# EAGLE design Modulo Ignicao Enertron.proto (EAGLE 7.4.0)
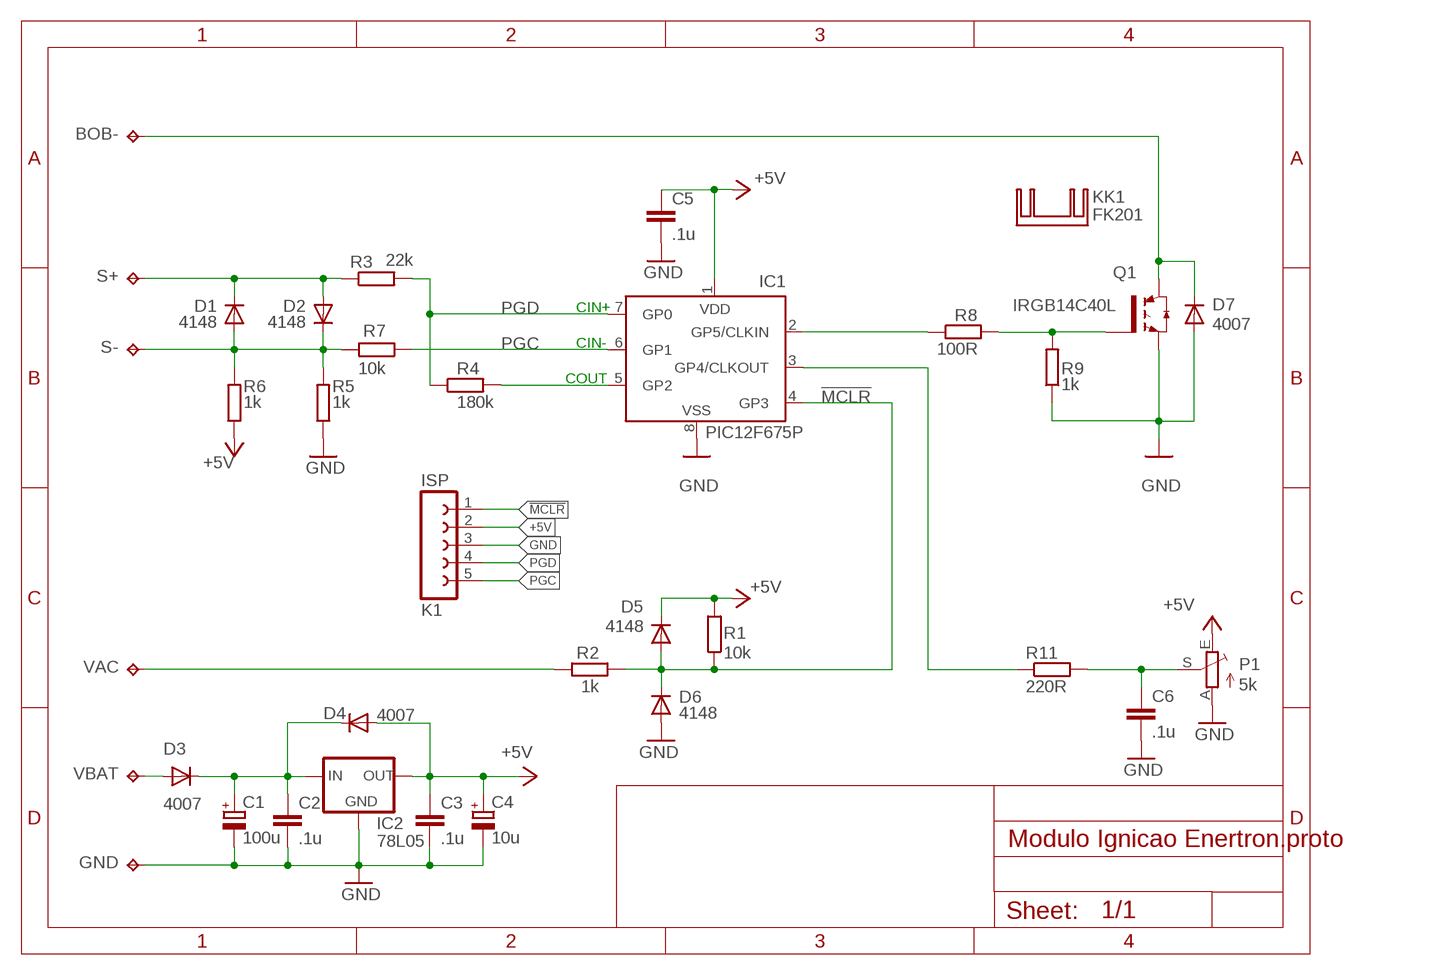
[diagram p0: schematic, sheet 1]

## Parts
BOB-  TPPAD1-13Y  [P1-13Y]
C1  100u  CPOL-EUE2.5-6  [E2,5-6]
C2  .1u  C-EUC050-025X075L  [C050-025X075L]
C3  .1u  C-EUC050-025X075L  [C050-025X075L]
C4  10u  CPOL-EUE2-4  [E2-4]
C5  .1u  C-EUC050-025X075L  [C050-025X075L]
C6  .1u  C-EUC050-025X075L  [C050-025X075L]
D1  4148  DIODE-D-5L  [D-5L]
D2  4148  DIODE-D-5L  [D-5L]
D3  4007  DIODE-D-7.5  [D-7.5]
D4  4007  DIODE-D-7.5  [D-7.5]
D5  4148  DIODE-D-5L  [D-5L]
D6  4148  DIODE-D-5L  [D-5L]
D7  4007  DIODE-DO07  [DO07]
GND  TPPAD1-13Y  [P1-13Y]
IC1  PIC12F675P  [DIL8]
IC2  78L05  78LXX-  [TO92-]
K1  ISP  FE05-1  [FE05-1]
KK1  FK201  [FK201]
P1  5k  TRIM_EU-CA6V  [CA6V]
Q1  IRGB14C40L  IRG4BC15UD--L  [TO262-V]
R1  10k  R-EU_0207/7L  [0207/7L]
R2  1k  R-EU_0207/7L  [0207/7L]
R3  22k  R-EU_0207/7L  [0207/7L]
R4  180k  R-EU_0207/7L  [0207/7L]
R5  1k  R-EU_0207/7L  [0207/7L]
R6  1k  R-EU_0207/7L  [0207/7L]
R7  10k  R-EU_0207/7L  [0207/7L]
R8  100R  R-EU_0207/7L  [0207/7L]
R9  1k  R-EU_0207/7L  [0207/7L]
R11  220R  R-EU_0207/7L  [0207/7L]
S+  TPPAD1-13Y  [P1-13Y]
S-  TPPAD1-13Y  [P1-13Y]
VAC  TPPAD1-13Y  [P1-13Y]
VBAT  TPPAD1-13Y  [P1-13Y]

## Nets
!MCLR: D5.A D6.C IC1.4(GP3) K1.1 R1.3 R2.3
+5V: C3.1 C4.+ C5.1 D4.A D5.C IC1.1(VDD) IC2.3(OUT) K1.2 P1.E R1.4 R6.3
COUT: IC1.5(GP2) R4.4
GND: C1.- C2.2 C3.2 C4.- C5.2 C6.2 D6.A D7.A GND.TP IC1.8(VSS) IC2.2(GND) K1.3 P1.A Q1.3(E) R5.3 R9.3
N$1: C1.+ C2.1 D3.C D4.C IC2.1(IN)
N$2: D1.A D2.C R5.4 R6.4 R7.4 S-.TP
N$3: IC1.2(GP5/CLKIN) R8.3
N$5: D1.C D2.A R3.3 S+.TP
N$6: Q1.1(G) R8.4 R9.4
N$7: D3.A VBAT.TP
N$8: IC1.3(GP4/CLKOUT) R11.3
N$9: C6.1 P1.S R11.4
N$10: BOB-.TP D7.C Q1.2(C)
N$11: R2.4 VAC.TP
PGC: IC1.6(GP1) K1.5 R7.3
PGD: IC1.7(GP0) K1.4 R3.4 R4.3

## Notes on the sheet
- CIN+
- CIN-
- COUT

## Library data of the parts
BOB- GND S+ S- VAC VBAT = testpad:TP: Test pad
C1 C4 = rcl:CPOL-EU: POLARIZED CAPACITOR, European symbol
C2 C3 C5 C6 = rcl:C-EU: CAPACITOR, European symbol
D1-D7 = diode:DIODE-: DIODE
IC1 = microchip:PIC12F6*: Data Sheet 8-Pin FLASH-Based 8-Bit CMOS Microcontrollers Source: http://www.microchip.com .. 41190c.pdf; MF: MICROCHIP; MPN: PIC12F675-E/P; OC_FARNELL: 9759018; OC_NEWARK: 92C4340
IC2 = v-reg:78LXX: VOLTAGE REGULATOR
K1 = con-lsta:FE05-1: FEMALE HEADER; OC_FARNELL: unknown; OC_NEWARK: unknown
KK1 = heatsink:FK201: HEATSINK manufacturer Fischer/distributor Buerklin
P1 = pot:TRIM_EU-: POTENTIOMETER
Q1 = transistor-power:IRG4BC15UD-: INSULATED GATE BIPOLAR TRANSISTOR WITH ULTRAFAST SOFT RECOVERY DIODE
R1-R9 R11 = rcl:R-EU_: RESISTOR, European symbol

## Board
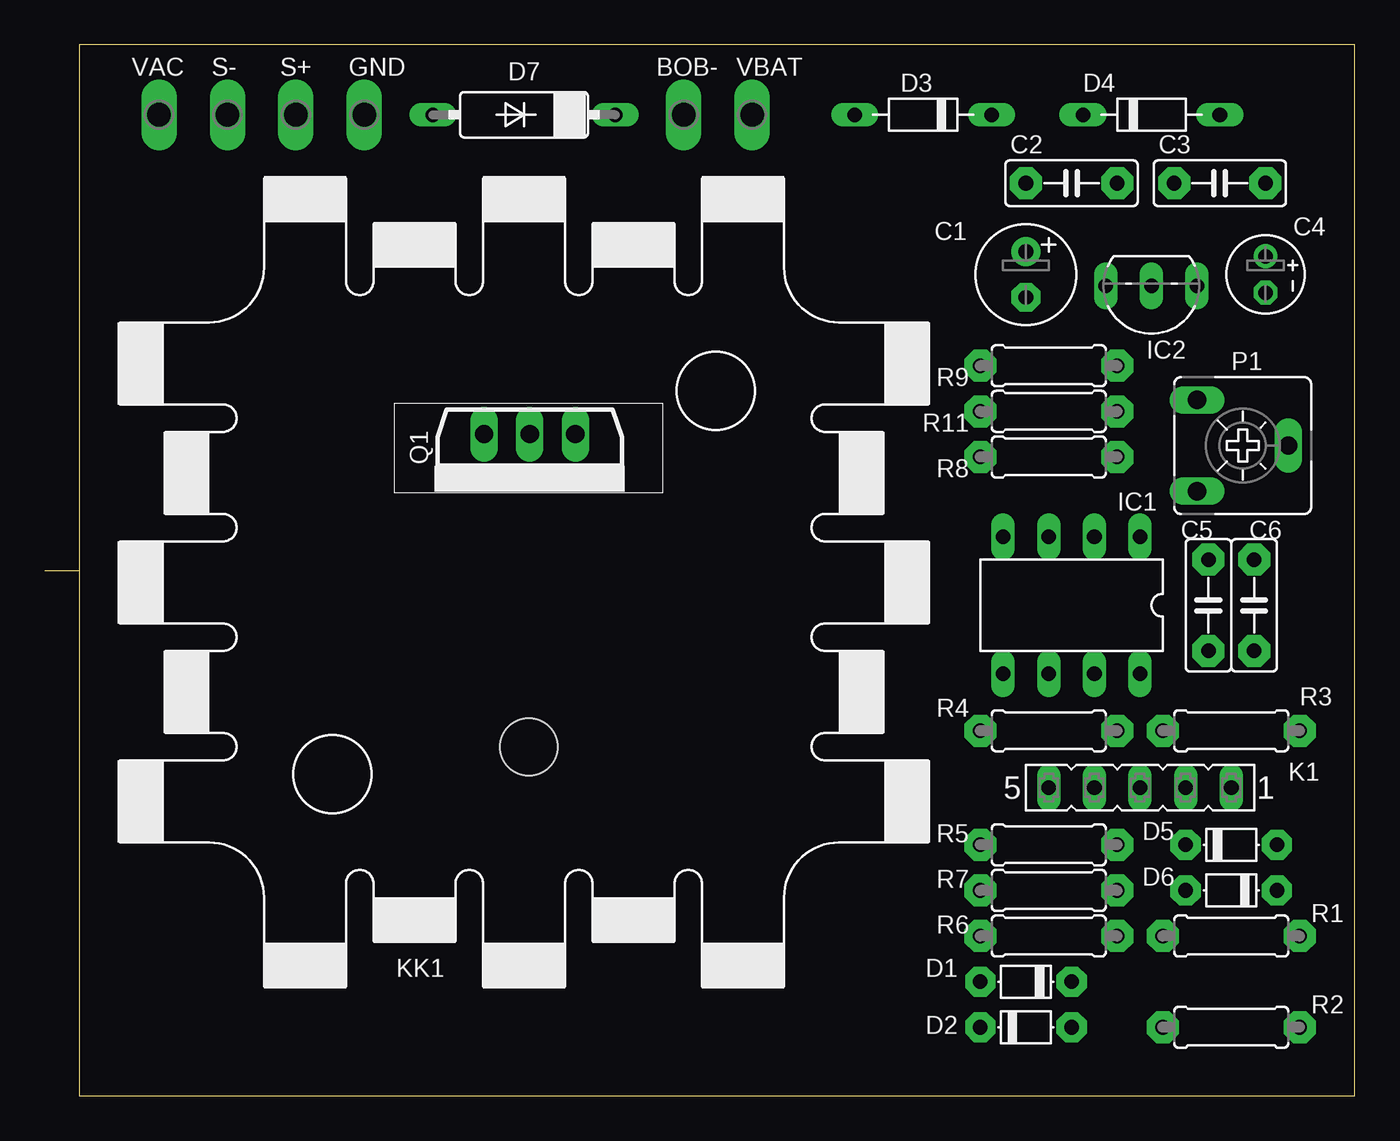
[diagram p1: board, top side]
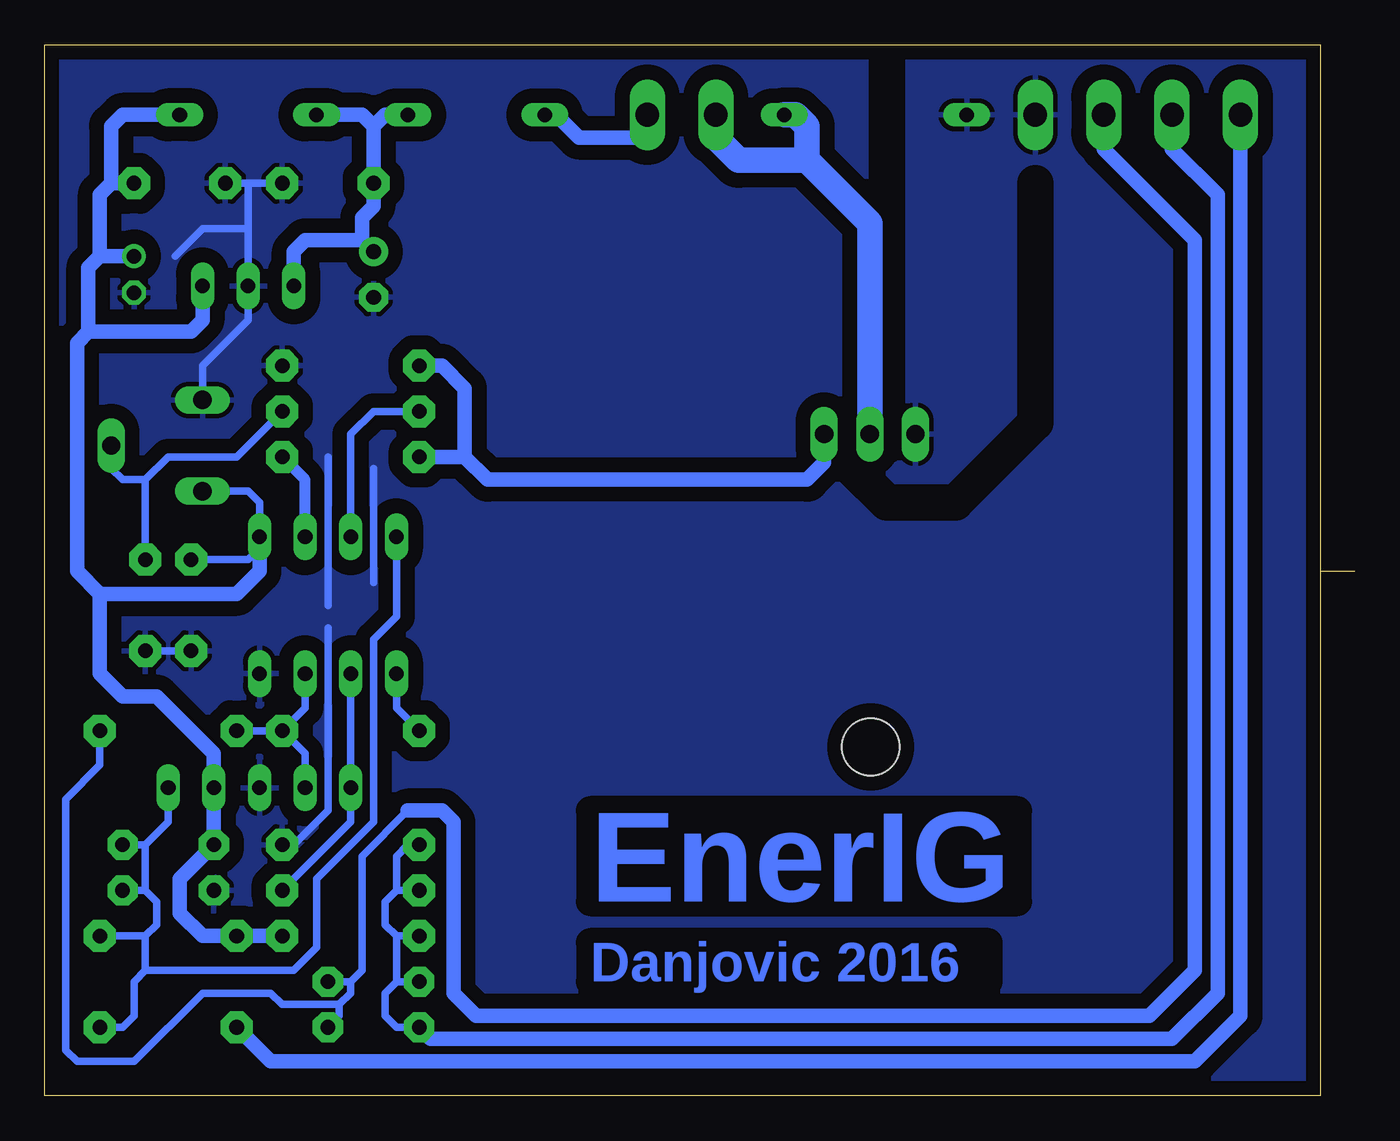
[diagram p2: board, bottom side, seen from below]

Size 72.91 x 58.5 mm. Coordinates in mm from the lower left corner, seen from the top.
Outline: 1.91,29.21 1.91,58.5 72.91,58.5 72.91,0 1.91,0 1.91,29.21
Outline: 1.91,29.21 0,29.21
Copper layers (1*16): Top 0.035mm / dielectric 1.5mm / Bottom 0.035mm
Design rules "default *": minimum track width 10mil, minimum drill 24mil, track to track 8mil, track to pad 8mil, pad to pad 8mil, via to via 8mil, smd to smd 8mil, copper to edge 25mil, drill to drill 8mil, minimum pad ring 10mil, minimum via ring 8mil, stop-mask expansion 4mil, vias tented up to drill 0mil, thermal gap 10mil
Holes 3.2 mm at 26.93,19.42
bRestrict: 5 lines

### Footprints (pad centres in the part's own frame; a part is rotated, then mirrored left to right if it is on the bottom)
P1-13Y = drill 1.321 pad 1.905 long: TP 0,0
E2,5-6 = drill 0.813 pad 1.6: + -1.27,0 | drill 0.813 pad 1.6 octagon: - 1.27,0
C050-025X075L = drill 0.813 pad 1.778 octagon: 1 -2.54,0; 2 2.54,0
E2-4 = drill 0.813 pad 1.27: + -1.016,0 | drill 0.813 pad 1.27 octagon: - 1.016,0
D-5L = drill 0.813 pad 1.676 octagon: A 2.54,0; C -2.54,0
D-7.5 = drill 0.813 long: A 3.81,0; C -3.81,0
DO07 = drill 0.813 long: A 5.08,0; C -5.08,0
DIL8 = drill 0.813 long: 1 -3.81,-3.81; 2 -1.27,-3.81; 3 1.27,-3.81; 4 3.81,-3.81; 5 3.81,3.81; 6 1.27,3.81; 7 -1.27,3.81; 8 -3.81,3.81
TO92- = drill 0.813 long: 1 2.54,0; 2 0,0; 3 -2.54,0
FE05-1 = drill 0.813 long: 1 -5.08,0; 2 -2.54,0; 3 0,0; 4 2.54,0; 5 5.08,0
CA6V = drill 1.016 long: A -2.54,-2.54; E 2.54,-2.54; S 0,2.54
TO262-V = drill 1.016 long: 1 -2.54,0; 2 0,0; 3 2.54,0
0207/7L = drill 0.813 pad 1.778 octagon: 3 -3.81,0; 4 3.81,0

### Placement (x,y rotation side)
BOB-  35.56,54.61 0 top
C1  54.61,45.72 270 top
C2  57.15,50.8 0 top
C3  65.41,50.8 180 top
C4  67.94,45.72 270 top
C5  64.77,27.3 270 top
C6  67.31,27.3 270 top
D1  54.61,6.35 180 top
D2  54.61,3.81 0 top
D3  48.9,54.61 180 top
D4  61.6,54.61 0 top
D5  66.04,13.97 0 top
D6  66.04,11.43 180 top
D7  26.67,54.61 180 top
GND  17.78,54.61 0 top
IC1  57.15,27.3 180 top
IC2  61.6,45.09 180 top
K1  60.96,17.14 180 top
KK1  26.67,28.57 90 top
P1  66.67,36.2 270 top
Q1  26.99,36.83 180 top
R1  66.04,8.89 180 top
R2  66.04,3.81 180 top
R3  66.04,20.32 180 top
R4  55.88,20.32 180 top
R5  55.88,13.97 180 top
R6  55.88,8.89 180 top
R7  55.88,11.43 180 top
R8  55.88,35.56 180 top
R9  55.88,40.64 180 top
R11  55.88,38.1 0 top
S+  13.97,54.61 180 top
S-  10.16,54.61 180 top
VAC  6.35,54.61 180 top
VBAT  39.37,54.61 0 top

### Tracks (layer width: path | path; a pad name or v marks a point on that pad's centre or on a via)
!MCLR
  Bottom 0.406: IC1.4 53.34,26.67 54.61,25.4 54.61,15.24 57.79,12.06 57.79,8.26 59.05,6.99 67.31,6.99 | 67.31,13.97 66.04,15.24 K1.1 | 67.31,13.97 67.31,11.43 | 67.31,11.43 66.67,10.79 66.67,9.53 67.31,8.89 | 67.31,8.89 67.31,6.99 | R1.3 67.31,8.89 | R2.3 68.58,3.81 67.94,4.45 67.94,6.35 67.31,6.99 | D5.A 67.31,13.97 | 67.31,11.43 D6.C
+5V
  Bottom 0.406: P1.E 61.6,33.66 60.96,33.02 IC1.1 | C5.1 61.6,29.84 60.96,30.48
  Bottom 0.813: 69.85,27.94 69.85,23.5 68.58,22.23 66.67,22.23 63.5,19.05 K1.2 D5.C 65.41,12.06 65.41,10.16 64.14,8.89 R1.4 R6.3 | 69.85,27.94 71.12,29.21 71.12,41.91 70.48,42.55 | 69.85,27.94 62.23,27.94 60.96,29.21 60.96,30.48 IC1.1 | IC2.3 64.14,43.18 64.77,42.55 70.48,42.55 | C4.+ 69.85,46.74 | 69.85,46.74 69.85,50.16 69.21,50.8 | 69.21,50.8 C3.1 | D4.A 68.58,54.61 69.21,53.98 69.21,50.8 | 70.48,42.55 70.48,46.1 69.85,46.74
COUT
  Bottom 0.406: IC1.5 53.34,21.59 R4.4
GND
  Bottom 0.406: C5.2 C6.2 | C2.2 61.6,50.8 | 61.6,50.8 C3.2 | 61.6,48.26 IC2.2 61.6,43.18 64.14,40.64 P1.A | 61.6,48.26 61.6,50.8 | 65.66,46.74 64.14,48.26 61.6,48.26 | 57.15,26.04 57.15,15.88 59.05,13.97 R5.3 | 54.61,34.92 54.61,28.57 | 57.15,35.56 57.15,27.3
  pour Bottom (isolate 0.813): 1.91,0 73.02,0 73.02,58.42 1.91,58.42
N$1
  Bottom 0.813: D3.C 53.98,54.61 54.61,53.98 | 54.61,53.98 55.25,54.61 D4.C | 54.61,53.98 C2.1 54.61,49.53 55.25,48.9 55.25,47.62 | 55.25,47.62 C1.+ | IC2.1 59.05,46.99 58.42,47.62 55.25,47.62
N$2
  Bottom 0.406: R5.4 52.71,13.97 53.34,13.34 53.34,11.43 | 53.34,11.43 53.98,10.79 53.98,9.53 53.34,8.89 | R7.4 53.34,11.43 | 53.34,8.89 53.34,6.35 | R6.4 53.34,8.89 | D1.A 53.34,6.35 | D2.C 53.34,3.81 53.98,4.45 53.98,5.71 53.34,6.35
  Bottom 0.813: D2.C 51.44,3.17 10.16,3.17 7.62,5.71 7.62,50.16 10.16,52.7 S-.TP
N$3
  Bottom 0.61: IC1.2 58.42,34.29 R8.3
N$5
  Bottom 0.406: 52.71,15.88 55.25,13.34 55.25,6.99 55.88,6.35 | 55.88,6.35 55.88,5.71 56.52,5.08 | 56.52,5.08 56.52,4.45 D2.A | 56.52,5.08 59.69,5.08 60.33,5.71 64.14,5.71 67.94,1.91 71.12,1.91 71.75,2.54 71.75,16.51 69.85,18.41 R3.3 | D1.C 55.88,6.35
  Bottom 0.813: S+.TP 13.97,52.7 8.89,47.62 8.89,6.99 11.43,4.45 48.9,4.45 50.17,5.71 50.17,15.24 50.8,15.88 52.71,15.88
N$6
  Bottom 0.813: Q1.1 29.53,35.24 30.48,34.29 48.26,34.29 49.53,35.56 | 49.53,35.56 R8.4 | R9.4 50.8,40.64 49.53,39.37 49.53,35.56
N$7
  Bottom 0.813: D3.A 44.45,54.61 43.18,53.34 40.01,53.34 39.37,53.98 VBAT.TP
N$8
  Bottom 0.406: IC1.3 55.88,36.83 54.61,38.1 R11.3
N$9
  Bottom 0.406: R11.4 62.23,35.56 66.04,35.56 67.31,34.29 | C6.1 67.31,34.29 | 67.31,34.29 68.58,34.29 69.21,34.92 P1.S
N$10
  Bottom 1.422: Q1.2 26.99,48.58 30.48,52.07 | 30.48,52.07 34.29,52.07 35.56,53.34 BOB-.TP | D7.C 31.11,54.61 30.48,53.98 30.48,52.07
N$11
  Bottom 0.813: VAC.TP 6.35,4.45 8.89,1.91 60.33,1.91 R2.4
PGC
  Bottom 0.406: R7.3 55.88,15.24 K1.5 IC1.6
PGD
  Bottom 0.406: K1.4 58.42,19.05 R4.3 | IC1.7 58.42,21.59 R4.3 | R4.3 R3.4

### Text on the board
Bottom: EnerIG | Danjovic 2016